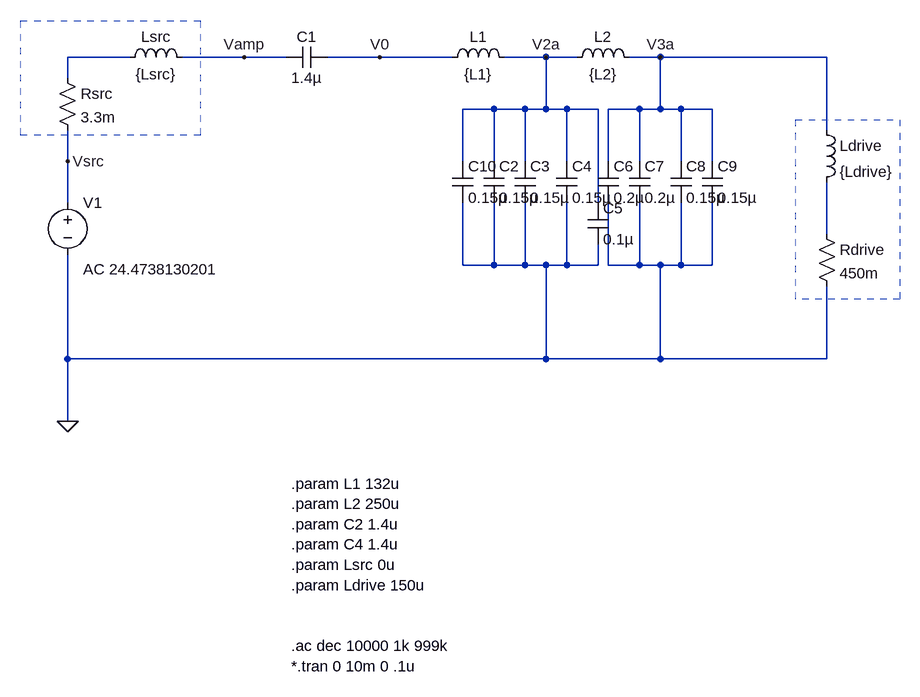
[diagram p0: schematic Tx_Filter_MPSv2_v1.asc]
Tx_Filter_MPSv2_v1.asc, the LTspice schematic file:
Version 4
SHEET 1 1196 1068
WIRE 0 112 -96 112
WIRE 176 112 80 112
WIRE 240 112 176 112
WIRE 384 112 304 112
WIRE 496 112 384 112
WIRE 640 112 576 112
WIRE 688 112 640 112
WIRE 816 112 768 112
WIRE 1072 112 816 112
WIRE -96 144 -96 112
WIRE 560 192 512 192
WIRE 608 192 560 192
WIRE 640 192 640 112
WIRE 640 192 608 192
WIRE 672 192 640 192
WIRE 720 192 672 192
WIRE 784 192 736 192
WIRE 816 192 816 112
WIRE 816 192 784 192
WIRE 848 192 816 192
WIRE 896 192 848 192
WIRE 1072 224 1072 112
WIRE -96 272 -96 224
WIRE 512 272 512 192
WIRE 560 272 560 192
WIRE 608 272 608 192
WIRE 672 272 672 192
WIRE 736 272 736 192
WIRE 784 272 784 192
WIRE 848 272 848 192
WIRE 896 272 896 192
WIRE -96 336 -96 272
WIRE 720 336 720 192
WIRE 1072 384 1072 304
WIRE 512 432 512 336
WIRE 560 432 560 336
WIRE 560 432 512 432
WIRE 608 432 608 336
WIRE 608 432 560 432
WIRE 640 432 608 432
WIRE 672 432 672 336
WIRE 672 432 640 432
WIRE 720 432 720 400
WIRE 720 432 672 432
WIRE 736 432 736 336
WIRE 784 432 784 336
WIRE 784 432 736 432
WIRE 816 432 784 432
WIRE 848 432 848 336
WIRE 848 432 816 432
WIRE 896 432 896 336
WIRE 896 432 848 432
WIRE -96 576 -96 416
WIRE 640 576 640 432
WIRE 640 576 -96 576
WIRE 816 576 816 432
WIRE 816 576 640 576
WIRE 1072 576 1072 464
WIRE 1072 576 816 576
WIRE -96 672 -96 576
FLAG -96 672 0
FLAG 640 112 V2a
FLAG 816 112 V3a
FLAG -96 272 Vsrc
FLAG 176 112 Vamp
FLAG 384 112 V0
SYMBOL voltage -96 320 R0
WINDOW 123 24 118 Left 2
WINDOW 39 0 0 Left 0
WINDOW 3 24 38 Left 2
SYMATTR Value2 AC 24.4738130201
SYMATTR Value ""
SYMATTR InstName V1
SYMBOL res -112 128 R0
SYMATTR InstName Rsrc
SYMATTR Value 3.3m
SYMBOL ind -16 128 R270
WINDOW 0 32 56 VTop 2
WINDOW 3 5 56 VBottom 2
SYMATTR InstName Lsrc
SYMATTR Value {Lsrc}
SYMBOL ind 480 128 R270
WINDOW 0 32 56 VTop 2
WINDOW 3 5 56 VBottom 2
SYMATTR InstName L1
SYMATTR Value {L1}
SYMATTR SpiceLine Rser=.1472
SYMBOL ind 672 128 R270
WINDOW 0 32 56 VTop 2
WINDOW 3 5 56 VBottom 2
SYMATTR InstName L2
SYMATTR Value {L2}
SYMATTR SpiceLine Rser=.3179
SYMBOL cap 304 96 R90
WINDOW 0 0 32 VBottom 2
WINDOW 3 32 32 VTop 2
SYMATTR InstName C1
SYMATTR Value 1.4µ
SYMBOL ind 1056 208 R0
SYMATTR InstName Ldrive
SYMATTR Value {Ldrive}
SYMBOL res 1056 368 R0
SYMATTR InstName Rdrive
SYMATTR Value 450m
SYMBOL cap 544 272 R0
SYMATTR InstName C2
SYMATTR Value 0.15µ
SYMBOL cap 592 272 R0
SYMATTR InstName C3
SYMATTR Value 0.15µ
SYMBOL cap 656 272 R0
SYMATTR InstName C4
SYMATTR Value 0.15µ
SYMBOL cap 720 272 R0
SYMATTR InstName C6
SYMATTR Value 0.2µ
SYMBOL cap 768 272 R0
SYMATTR InstName C7
SYMATTR Value 0.2µ
SYMBOL cap 832 272 R0
SYMATTR InstName C8
SYMATTR Value 0.15µ
SYMBOL cap 880 272 R0
SYMATTR InstName C9
SYMATTR Value 0.15µ
SYMBOL cap 704 336 R0
SYMATTR InstName C5
SYMATTR Value 0.1µ
SYMBOL cap 496 272 R0
SYMATTR InstName C10
SYMATTR Value 0.15µ
TEXT 248 768 Left 2 !.param L1 132u\n.param L2 250u\n.param C2 1.4u\n.param C4 1.4u\n.param Lsrc 0u\n.param Ldrive 150u\n\n\n.ac dec 10000 1k 999k\n*.tran 0 10m 0 .1u
RECTANGLE Normal -168 56 108 232 2
RECTANGLE Normal 1024 208 1184 484 2

The netlist it stands for:
* Tx_Filter_MPSv2_v1.asc
V1 Vsrc 0 AC 24.4738130201
Rsrc N001 Vsrc 3.3m
Lsrc N001 Vamp {Lsrc}
L1 V0 V2a {L1} Rser=.1472
L2 V2a V3a {L2} Rser=.3179
C1 V0 Vamp 1.4µ
Ldrive V3a N002 {Ldrive}
Rdrive N002 0 450m
C2 V2a 0 0.15µ
C3 V2a 0 0.15µ
C4 V2a 0 0.15µ
C6 V3a 0 0.2µ
C7 V3a 0 0.2µ
C8 V3a 0 0.15µ
C9 V3a 0 0.15µ
C5 V2a 0 0.1µ
C10 V2a 0 0.15µ
.param L1 132u
.param L2 250u
.param C2 1.4u
.param C4 1.4u
.param Lsrc 0u
.param Ldrive 150u
.ac dec 10000 1k 999k
*.tran 0 10m 0 .1u
.backanno
.end